# EAGLE design board (EAGLE 6.5.0)
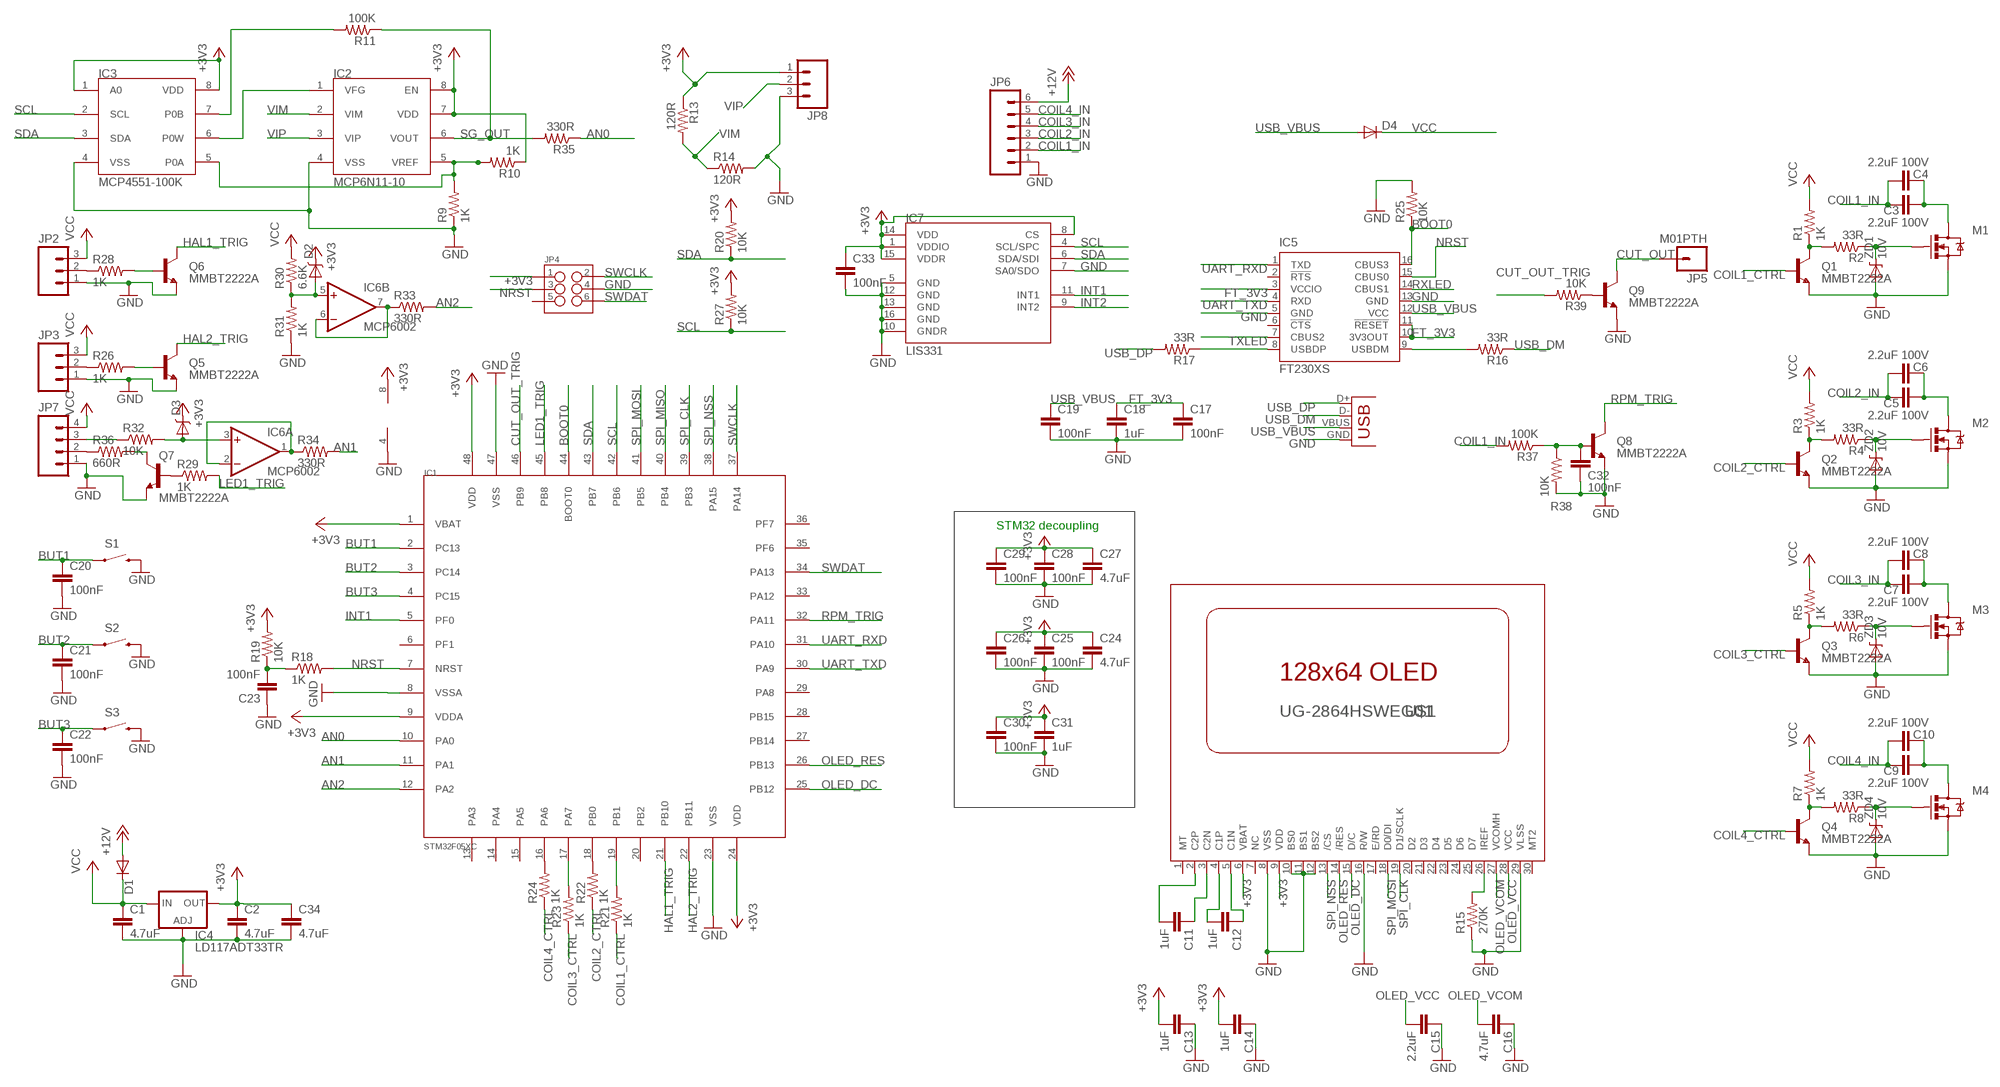
[diagram p0: schematic, sheet 1]

## Parts
C1  4.7uF  CAP0603-CAP  [0603-CAP]
C2  4.7uF  CAP0603-CAP  [0603-CAP]
C3  2.2uF 100V  2.2UF-CERCAP-10009  [1206]
C4  2.2uF 100V  2.2UF-CERCAP-10009  [1206]
C5  2.2uF 100V  2.2UF-CERCAP-10009  [1206]
C6  2.2uF 100V  2.2UF-CERCAP-10009  [1206]
C7  2.2uF 100V  2.2UF-CERCAP-10009  [1206]
C8  2.2uF 100V  2.2UF-CERCAP-10009  [1206]
C9  2.2uF 100V  2.2UF-CERCAP-10009  [1206]
C10  2.2uF 100V  2.2UF-CERCAP-10009  [1206]
C11  1uF  CAP0603-CAP  [0603-CAP]
C12  1uF  CAP0603-CAP  [0603-CAP]
C13  1uF  CAP0603-CAP  [0603-CAP]
C14  1uF  CAP0603-CAP  [0603-CAP]
C15  2.2uF  CAP0603-CAP  [0603-CAP]
C16  4.7uF  CAP0603-CAP  [0603-CAP]
C17  100nF  CAP0603-CAP  [0603-CAP]
C18  1uF  CAP0603-CAP  [0603-CAP]
C19  100nF  CAP0603-CAP  [0603-CAP]
C20  100nF  CAP0603-CAP  [0603-CAP]
C21  100nF  CAP0603-CAP  [0603-CAP]
C22  100nF  CAP0603-CAP  [0603-CAP]
C23  100nF  CAP0603-CAP  [0603-CAP]
C24  4.7uF  CAP0603-CAP  [0603-CAP]
C25  100nF  CAP0603-CAP  [0603-CAP]
C26  100nF  CAP0603-CAP  [0603-CAP]
C27  4.7uF  CAP0603-CAP  [0603-CAP]
C28  100nF  CAP0603-CAP  [0603-CAP]
C29  100nF  CAP0603-CAP  [0603-CAP]
C30  100nF  CAP0603-CAP  [0603-CAP]
C31  1uF  CAP0603-CAP  [0603-CAP]
C32  100nF  CAP0603-CAP  [0603-CAP]
C33  100nF  CAP0603-CAP  [0603-CAP]
C34  4.7uF  CAP0603-CAP  [0603-CAP]
D1  DIODESMA  [SMA-DIODE]
D2  BAT20JFILM  [SOD-323]
D3  BAT20JFILM  [SOD-323]
D4  DIODESMA  [SMA-DIODE]
IC1  STM32F05XC  [LQFP-48]
IC2  MCP6N11-10  MCP6N11  [SO08]
IC3  MCP4551-100K  MCP45X1  [MSOP-8]
IC4  LD117ADT33TR  [DPACK]
IC5  FT230XS  [SSOP16]
IC6  MCP6002  TL072D  [SO08]
IC7  LIS331  [LGA16-3MM]
JP1  USBSMD  [USB-MINIB]
JP2  M03PTH  [1X03]
JP3  M03PTH  [1X03]
JP4  M03X22X3_SILK_SM  [2X3]
JP5  M01PTH  [1X01]
JP6  M063.5MM-6  [SCREWTERMINAL-3.5MM-6]
JP7  M04PTH  [1X04]
JP8  M03PTH  [1X03]
M1  MOSFET-NCHANNELFDD8580  [DPAK]
M2  MOSFET-NCHANNELFDD8580  [DPAK]
M3  MOSFET-NCHANNELFDD8580  [DPAK]
M4  MOSFET-NCHANNELFDD8580  [DPAK]
Q1  MMBT2222A  TRANSISTOR_NPNMMBT2222A  [SOT23]
Q2  MMBT2222A  TRANSISTOR_NPNMMBT2222A  [SOT23]
Q3  MMBT2222A  TRANSISTOR_NPNMMBT2222A  [SOT23]
Q4  MMBT2222A  TRANSISTOR_NPNMMBT2222A  [SOT23]
Q5  MMBT2222A  TRANSISTOR_NPNMMBT2222A  [SOT23]
Q6  MMBT2222A  TRANSISTOR_NPNMMBT2222A  [SOT23]
Q7  MMBT2222A  TRANSISTOR_NPNMMBT2222A  [SOT23]
Q8  MMBT2222A  TRANSISTOR_NPNMMBT2222A  [SOT23]
Q9  MMBT2222A  TRANSISTOR_NPNMMBT2222A  [SOT23]
R1  1K  RESISTOR0603-RES  [0603-RES]
R2  33R  RESISTOR0603-RES  [0603-RES]
R3  1K  RESISTOR0603-RES  [0603-RES]
R4  33R  RESISTOR0603-RES  [0603-RES]
R5  1K  RESISTOR0603-RES  [0603-RES]
R6  33R  RESISTOR0603-RES  [0603-RES]
R7  1K  RESISTOR0603-RES  [0603-RES]
R8  33R  RESISTOR0603-RES  [0603-RES]
R9  1K  RESISTOR0603-RES  [0603-RES]
R10  1K  RESISTOR0603-RES  [0603-RES]
R11  100K  RESISTOR0603-RES  [0603-RES]
R13  120R  RESISTOR0603-RES  [0603-RES]
R14  120R  RESISTOR0603-RES  [0603-RES]
R15  270K  RESISTOR0603  [0603-RES]
R16  33R  RESISTOR0603-RES  [0603-RES]
R17  33R  RESISTOR0603-RES  [0603-RES]
R18  1K  RESISTOR0603-RES  [0603-RES]
R19  10K  RESISTOR0603-RES  [0603-RES]
R20  10K  RESISTOR0603-RES  [0603-RES]
R21  1K  RESISTOR0603-RES  [0603-RES]
R22  1K  RESISTOR0603-RES  [0603-RES]
R23  1K  RESISTOR0603-RES  [0603-RES]
R24  1K  RESISTOR0603-RES  [0603-RES]
R25  10K  RESISTOR0603-RES  [0603-RES]
R26  1K  RESISTOR0603-RES  [0603-RES]
R27  10K  RESISTOR0603-RES  [0603-RES]
R28  1K  RESISTOR0603-RES  [0603-RES]
R29  1K  RESISTOR0603-RES  [0603-RES]
R30  6.6K  RESISTOR0603-RES  [0603-RES]
R31  1K  RESISTOR0603-RES  [0603-RES]
R32  10K  RESISTOR0603-RES  [0603-RES]
R33  330R  RESISTOR0603-RES  [0603-RES]
R34  330R  RESISTOR0603-RES  [0603-RES]
R35  330R  RESISTOR0603-RES  [0603-RES]
R36  660R  RESISTOR1206  [1206]
R37  100K  RESISTOR1206  [1206]
R38  10K  RESISTOR0603-RES  [0603-RES]
R39  10K  RESISTOR0603-RES  [0603-RES]
S1  SWITCH-MOMENTARY-2  [TACTILE_SWITCH_TALL]
S2  SWITCH-MOMENTARY-2  [TACTILE_SWITCH_TALL]
S3  SWITCH-MOMENTARY-2  [TACTILE_SWITCH_TALL]
U$1  UG-2864HSWEG01  [1X30-0.7MM]
ZD1  10V  DIODE-ZENER-BZT52  [SOD-323]
ZD2  10V  DIODE-ZENER-BZT52  [SOD-323]
ZD3  10V  DIODE-ZENER-BZT52  [SOD-323]
ZD4  10V  DIODE-ZENER-BZT52  [SOD-323]

## Nets
+3V3: C2.1 C13.2 C14.2 C24.1 C25.1 C26.1 C27.1 C28.1 C29.1 C30.1 C31.1 C33.1 C34.1 D2.1(C) D3.1(C) IC1.1(VBAT) IC1.9(VDDA) IC1.24(VDD) IC1.48(VDD) IC2.7(VDD) IC2.8(EN) IC3.1(A0) IC3.8(VDD) IC4.4(OUT) IC6.8(P:V+) IC7.1(VDDIO) IC7.8(CS) IC7.14(VDD) IC7.15(VDDR) JP4.1 JP8.1 R10.1 R13.1 R19.2 R20.2 R27.2 U$1.6(VBAT) U$1.9(VDD)
+12V: D1.A JP6.6
AN0: IC1.10(PA0) R35.1
AN1: IC1.11(PA1) R34.2
AN2: IC1.12(PA2) R33.2
BOOT0: IC1.44(BOOT0) IC5.16(CBUS3) R25.1
BUT1: C20.1 IC1.2(PC13) S1.A2
BUT2: C21.1 IC1.3(PC14) S2.A2
BUT3: C22.1 IC1.4(PC15) S3.A2
COIL1_CTRL: Q1.1(B) R21.1
COIL1_IN [HV]: C3.1 C4.1 JP6.2 R37.2
COIL2_CTRL: Q2.1(B) R22.1
COIL2_IN [HV]: C5.1 C6.1 JP6.3
COIL3_CTRL: Q3.1(B) R23.1
COIL3_IN [HV]: C7.1 C8.1 JP6.4
COIL4_CTRL: Q4.1(B) R24.1
COIL4_IN [HV]: C9.1 C10.1 JP6.5
CUT_OUT: JP5.1 Q9.3(C)
CUT_OUT_TRIG: IC1.46(PB9) R39.2
FT_3V3: C17.1 C18.1 IC5.3(VCCIO) IC5.10(3V3OUT) IC5.11(!RESET)
GND: C1.2 C2.2 C13.1 C14.1 C15.1 C16.1 C17.2 C18.2 C19.2 C20.2 C21.2 C22.2 C23.1 C24.2 C25.2 C26.2 C27.2 C28.2 C29.2 C30.2 C31.2 C32.2 C33.2 C34.2 IC1.8(VSSA) IC1.23(VSS) IC1.47(VSS) IC2.4(VSS) IC3.4(VSS) IC4.1(ADJ) IC5.5(GND) IC5.13(GND) IC6.4(P:V-) IC7.5(GND) IC7.7(SA0/SDO) IC7.10(GNDR) IC7.12(GND) IC7.13(GND) IC7.16(GND) JP1.GND JP2.1 JP3.1 JP4.4 JP6.1 JP7.1 JP8.3 M1.3(S) M2.3(S) M3.3(S) M4.3(S) Q1.2(E) Q2.2(E) Q3.2(E) Q4.2(E) Q5.2(E) Q6.2(E) Q7.2(E) Q8.2(E) Q9.2(E) R9.1 R14.2 R15.1 R25.2 R31.1 R38.2 S1.B2 S2.B2 S3.B2 U$1.8(VSS) U$1.10(BS0) U$1.11(BS1) U$1.12(BS2) U$1.16(R/W) U$1.29(VLSS) ZD1.2(A) ZD2.2(A) ZD3.2(A) ZD4.2(A)
HAL1_TRIG: IC1.21(PB10) Q6.3(C)
HAL2_TRIG: IC1.22(PB11) Q5.3(C)
INT1: IC1.5(PF0) IC7.11(INT1)
INT2: IC7.9(INT2)
LED1_TRIG: IC1.45(PB8) R29.2
N$1 [HV]: C3.2 C4.2 M1.4(D)
N$2: M1.1(G) R2.1 ZD1.1(C)
N$3 [HV]: C5.2 C6.2 M2.4(D)
N$4: M2.1(G) R4.1 ZD2.1(C)
N$5 [HV]: C7.2 C8.2 M3.4(D)
N$6: M3.1(G) R6.1 ZD3.1(C)
N$7 [HV]: C9.2 C10.2 M4.4(D)
N$8: M4.1(G) R8.1 ZD4.1(C)
N$9: IC2.1(VFG) IC3.6(P0W)
N$10: C12.2 U$1.4(C1P)
N$11: IC1.16(PA6) R24.2
N$12: IC2.5(VREF) IC3.5(P0A) R9.2 R10.2
N$13: C12.1 U$1.5(C1N)
N$14: IC3.7(P0B) R11.2
N$15: C11.1 U$1.3(C2N)
N$16: C11.2 U$1.2(C2P)
N$17: C23.2 R18.1 R19.1
N$18: R15.2 U$1.26(IREF)
N$19: IC1.17(PA7) R23.2
N$20: IC1.18(PB0) R22.2
N$21: IC5.8(USBDP) R17.1
N$22: IC5.9(USBDM) R16.2
N$23: IC1.19(PB1) R21.2
N$24: D2.2(A) IC6.5(B:+IN) R30.1 R31.2
N$25: D3.2(A) IC6.3(A:+IN) R32.2
N$26: JP7.3 R32.1
N$27: Q7.1(B) R29.1
N$28: JP7.2 R36.1
N$29: IC6.6(B:-IN) IC6.7(B:OUT) R33.1
N$30: Q5.1(B) R26.2
N$31: JP3.2 R26.1
N$32: Q6.1(B) R28.2
N$33: JP2.2 R28.1
N$34: Q7.3(C) R36.2
N$35: IC6.1(A:OUT) IC6.2(A:-IN) R34.1
N$36: C32.1 Q8.1(B) R37.1 R38.1
N$37: Q9.1(B) R39.1
NMOS1_GATE: Q1.3(C) R1.1 R2.2
NMOS2_GATE: Q2.3(C) R3.1 R4.2
NMOS3_GATE: Q3.3(C) R5.1 R6.2
NMOS4_GATE: Q4.3(C) R7.1 R8.2
NRST: IC1.7(NRST) IC5.15(CBUS0) JP4.3 R18.2
OLED_DC: IC1.25(PB12) U$1.15(D/C)
OLED_RES: IC1.26(PB13) U$1.14(/RES)
OLED_VCC: C15.2 U$1.28(VCC)
OLED_VCOM: C16.2 U$1.27(VCOMH)
RPM_TRIG: IC1.32(PA11) Q8.3(C)
RXLED: IC5.14(CBUS1)
SCL: IC1.42(PB6) IC3.2(SCL) IC7.4(SCL/SPC) R27.1
SDA: IC1.43(PB7) IC3.3(SDA) IC7.6(SDA/SDI) R20.1
SG_OUT: IC2.6(VOUT) R11.1 R35.2
SPI_CLK: IC1.39(PB3) U$1.19(D1/SCLK)
SPI_MISO: IC1.40(PB4)
SPI_MOSI: IC1.41(PB5) U$1.18(D0/DI)
SPI_NSS: IC1.38(PA15) U$1.13(/CS)
SWCLK: IC1.37(PA14) JP4.2
SWDAT: IC1.34(PA13) JP4.6
TXLED: IC5.7(CBUS2)
UART_RXD: IC1.31(PA10) IC5.1(TXD)
UART_TXD: IC1.30(PA9) IC5.4(RXD)
USB_DM: JP1.D- R16.1
USB_DP: JP1.D+ R17.2
USB_VBUS: C19.1 D4.A IC5.12(VCC) JP1.VBUS
VCC: C1.1 D1.C D4.C IC4.3(IN) JP2.3 JP3.3 JP7.4 R1.2 R3.2 R5.2 R7.2 R30.2
VIM: IC2.2(VIM) R13.2 R14.1
VIP: IC2.3(VIP) JP8.2
Unconnected: IC1.6(PF1) IC1.13(PA3) IC1.14(PA4) IC1.15(PA5) IC1.20(PB2) IC1.27(PB14) IC1.28(PB15) IC1.29(PA8) IC1.33(PA12) IC1.35(PF6) IC1.36(PF7) IC5.2(!RTS) IC5.6(!CTS) JP4.5 U$1.1(MT) U$1.7(NC) U$1.17(E/RD) U$1.20(D2) U$1.21(D3) U$1.22(D4) U$1.23(D5) U$1.24(D6) U$1.25(D7) U$1.30(MT2)

## Notes on the sheet
- STM32 decoupling

## Library data of the parts
C1 C2 C24 C27 C34 = SparkFun-Passives:CAP: Capacitor Standard 0603 ceramic capacitor, and 0.1" leaded capacitor.
C3-C10 = SparkFun-Capacitors:2.2UF-CER: 2.2uF Ceramic SMT CAP-07888- 10V, 20% (0603) CAP-10009- 50V, 10% (1206); PROD_ID: CAP-10009; VALUE: 2.2uF
C11-C23 C25 C26 C28-C33 = SparkFun-Capacitors:CAP: Capacitor Standard 0603 ceramic capacitor, and 0.1" leaded capacitor.
D1 D4 = SparkFun-DiscreteSemi:DIODE: Diode These are standard reverse protection diodes and small signal diodes. SMA package can handle up to about 1A. SOD-323 can handle about 200mA. What the SOD-323 package when ordering, there are some mfgs out there that are 5-pin packages.
D2 D3 = SparkFun-DiscreteSemi:BAT20JFILM: 23V, 1A Schottky diode, SOD-323 package; PROD_ID: DIO-11623; VALUE: BAT20JFILM
IC1 = misc:STM32F05XC
IC2 = misc:MCP6N11
IC3 = misc:MCP45X1
IC4 = v-reg:LD117A?*: Low drop fixed and adjustable positive voltage regulators 1 A Source: http://www.st.com/stonline/products/literature/ds/7194/ld1117axx.pdf
IC5 = ftdichip:FT230X: USB to BASIC UART IC Auto generated by make-symbol-device-package-bsdl.ulp Rev. 43 Source: Data sheet <http://www.ftdichip.com/Support/Documents/DataSheets/ICs/DS_FT230X.pdf>
IC6 = linear:TL072: OP AMP
IC7 = SparkFun-Sensors:LIS331: 3-axis 6/12/24g SPI/I2C accelerometer
JP1 = SparkFun-Connectors:USB: USB Connectors USB-B-PTH is fully proven SKU : PRT-00139/CONN-08278 USB-miniB is fully proven SKU : PRT-00587 USB-A-PCB is untested. USB-A-H is throughly reviewed, but untested. Spark Fun Electronics SKU : PRT-00437 USB-B-SMT is throughly reviewed, but untested. Needs silkscreen touching up. USB-A-S has not been used/tested USB-MB-H has not been used/tested USB-MICROB has been used. CONN-09505
JP2 JP3 JP8 = SparkFun-Connectors:M03: Header 3 Standard 3-pin 0.1" header. Use with straight break away headers (SKU : PRT-00116), right angle break away headers (PRT-00553), swiss pins (PRT-00743), machine pins (PRT-00117), and female headers (PRT-00115). Molex polarized connector foot print use with SKU : PRT-08232 with associated crimp pins and housings.
JP4 = SparkFun-Connectors:M03X2: 2x3 .1" header. Shrouded, with keying- CONN-10681 SMT- CONN-11415 Pogo pins- HW-11044
JP5 = SparkFun-Connectors:M01: Header 1 Standard 1-pin 0.1" header. Use with straight break away headers (SKU : PRT-00116), right angle break away headers (PRT-00553), swiss pins (PRT-00743), machine pins (PRT-00117), and female headers (PRT-00115).
JP6 = SparkFun-Connectors:M06: Header 6 Standard 6-pin 0.1" header. Use with straight break away headers (SKU : PRT-00116), right angle break away headers (PRT-00553), swiss pins (PRT-00743), machine pins (PRT-00117), and female headers (PRT-00115). Molex polarized connector foot print use with SKU : PRT-08094 with associated crimp pins and housings. NOTES ON THE VARIANTS LOCK and LOCK_LONGPADS... This footprint was designed to help hold the alignment of a through-hole component (i.e. 6-pin header) while soldering it into place. You may notice that each hole has been shifted either up or down by 0.005 of an inch from it's more standard position (which is a perfectly straight line). This slight alteration caused the pins (the squares in the middle) to touch the edges of the holes. Because they are alternating, it causes a "brace" to hold the component in place. 0.005 has proven to be the perfect amount of "off-center" position when using our standard breakaway headers. Although looks a little odd when you look at the bare footprint, once you have a header in there, the alteration is very hard to notice. Also, if you push a header all the way into place, it is covered up entirely on the bottom side. This idea of altering the position of holes to aid alignment will be further integrated into the Sparkfun Library for other footprints. It can help hold any component with 3 or more connection pins.
JP7 = SparkFun-Connectors:M04: Header 4 Standard 4-pin 0.1" header. Use with straight break away headers (SKU : PRT-00116), right angle break away headers (PRT-00553), swiss pins (PRT-00743), machine pins (PRT-00117), and female headers (PRT-00115). Molex polarized connector foot print use with SKU : PRT-08231 with associated crimp pins and housings. 1MM SMD Version SKU: PRT-10208
M1-M4 = SparkFun-DiscreteSemi:MOSFET-NCHANNEL: Generic NMOS footprint
Q1-Q9 = SparkFun-DiscreteSemi:TRANSISTOR_NPN: Generic NPN BJT MMBT2222A - TRANS-08049 (SOT-23, 1A 40V) MPSA42 - TRANS-09116 (SOT-23, 500mA 300V) MMBT5088LT1G - TRANS-11160 (SOT-23, 50 mA 30V); PROD_ID: TRANS-08049
R1-R11 R13-R39 = SparkFun-Resistors:RESISTOR: Resistor Basic schematic elements and footprints for 0603, 1206, and PTH resistors.
S1-S3 = SparkFun-Electromechanical:SWITCH-MOMENTARY-2: Various NO switches- pushbuttons, reed, etc
U$1 = SparkFun:UG-2864HSWEG01: UG-2864HSWEG01 OLED display
ZD1-ZD4 = SparkFun-DiscreteSemi:DIODE-ZENER: Zener Diode Production Part - 8199 3.4V Zener Voltage

## Net classes
1 HV: width 0.813 mm, clearance 0.61 mm

## Board
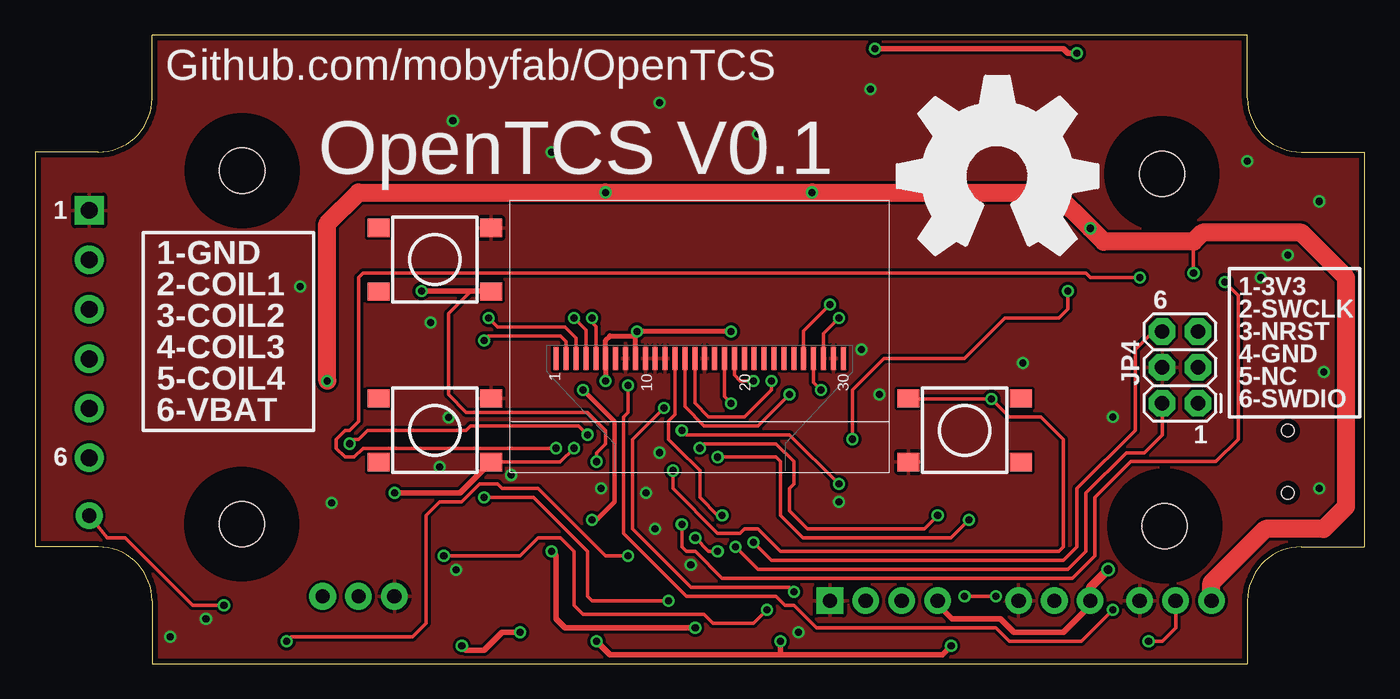
[diagram p1: board, top side]
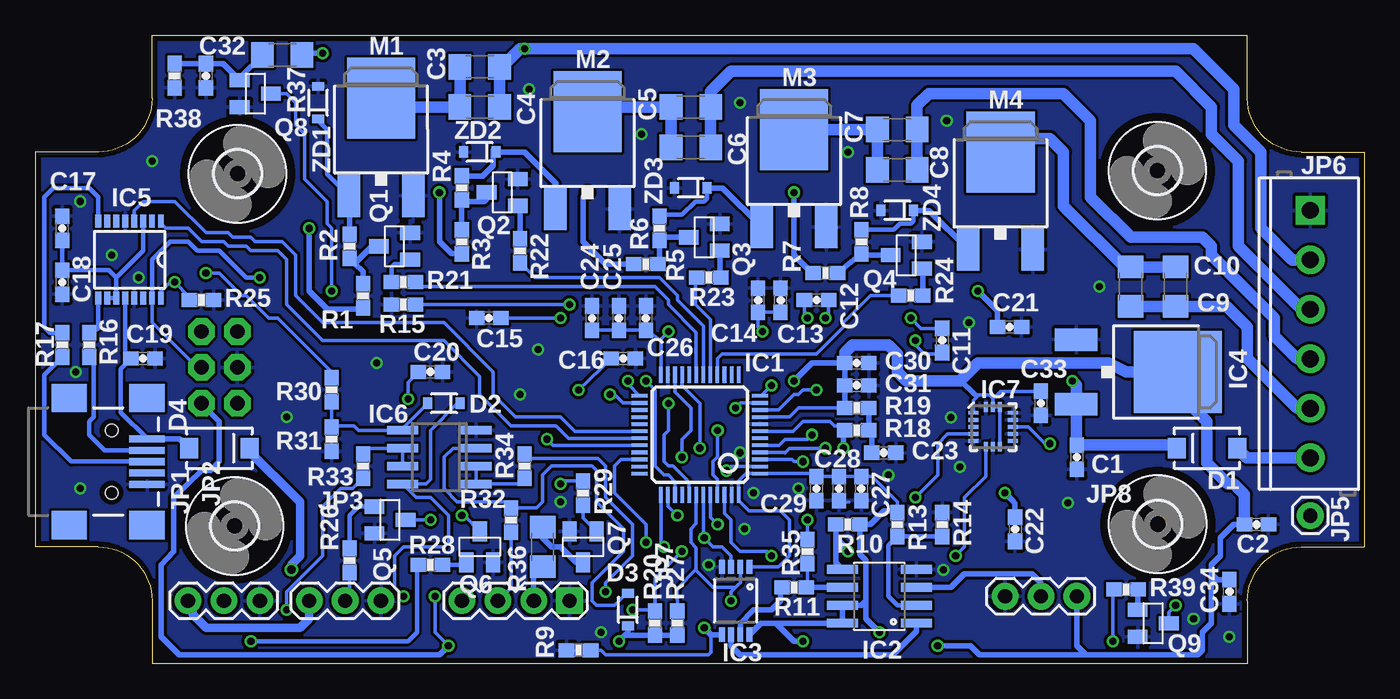
[diagram p2: board, bottom side, seen from below]

Size 93.98 x 44.45 mm. Coordinates in mm from the lower left corner, seen from the top.
Outline: 8.26,0 85.72,0 85.72,4.45 arc-90 89.53,8.26 93.98,8.26 93.98,36.2 89.53,36.2 arc-90 85.72,40.01 85.72,44.45 8.26,44.45 8.26,40.01 arc-90 4.45,36.2 0,36.2 0,8.26 4.45,8.26 arc-90 8.26,4.45 8.26,0
Copper layers (1*16): Top 0.0356mm / dielectric 1.5011mm / Bottom 0.0356mm
Design rules "LaenPCBOrder *": minimum track width 6mil, minimum drill 0.5mm, track to track 8mil, track to pad 8mil, pad to pad 8mil, via to via 8mil, smd to smd 8mil, copper to edge 15mil, drill to drill 6mil, minimum pad ring 7mil, minimum via ring 7mil, stop-mask expansion 4mil, vias tented up to drill 100mil, thermal gap 10mil

### Footprints (pad centres in the part's own frame; a part is rotated, then mirrored left to right if it is on the bottom)
0603-CAP = smd 1.1 x 1: 1 -0.85,0; 2 0.85,0
1206 = smd 1.6 x 1.8: 1 -1.4,0; 2 1.4,0
SMA-DIODE = smd 1.27 x 1.47: A -2.15,0; C 2.15,0
SOD-323 = smd 0.63 x 0.83: 1 -1.15,0; 2 1.15,0
LQFP-48 = smd 0.254 x 1.143: 1 -2.75,-4.25; 2 -2.25,-4.25; 3 -1.75,-4.25; 4 -1.25,-4.25; 5 -0.75,-4.25; 6 -0.25,-4.25; 7 0.25,-4.25; 8 0.75,-4.25; 9 1.25,-4.25; 10 1.75,-4.25; 11 2.25,-4.25; 12 2.75,-4.25; 25 2.75,4.25; 26 2.25,4.25; 27 1.75,4.25; 28 1.25,4.25; 29 0.75,4.25; 30 0.25,4.25; 31 -0.25,4.25; 32 -0.75,4.25; 33 -1.25,4.25; 34 -1.75,4.25; 35 -2.25,4.25; 36 -2.75,4.25 | smd 1.143 x 0.254: 13 4.25,-2.75; 14 4.25,-2.25; 15 4.25,-1.75; 16 4.25,-1.25; 17 4.25,-0.75; 18 4.25,-0.25; 19 4.25,0.25; 20 4.25,0.75; 21 4.25,1.25; 22 4.25,1.75; 23 4.25,2.25; 24 4.25,2.75; 37 -4.25,2.75; 38 -4.25,2.25; 39 -4.25,1.75; 40 -4.25,1.25; 41 -4.25,0.75; 42 -4.25,0.25; 43 -4.25,-0.25; 44 -4.25,-0.75; 45 -4.25,-1.25; 46 -4.25,-1.75; 47 -4.25,-2.25; 48 -4.25,-2.75
SO08 = smd 0.61 x 2.21: 1 -1.905,-2.616; 2 -0.635,-2.616; 3 0.635,-2.616; 4 1.905,-2.616; 5 1.905,2.616; 6 0.635,2.616; 7 -0.635,2.616; 8 -1.905,2.616
MSOP-8 = smd 0.41 x 1.02: 1 -0.975,-2.4; 2 -0.325,-2.4; 3 0.325,-2.4; 4 0.975,-2.4; 5 0.975,2.4; 6 0.325,2.4; 7 -0.325,2.4; 8 -0.975,2.4
DPACK = smd 1.6 x 3: 1 -2.28,-4.8; 3 2.28,-4.8 | smd 5.8 x 6.2: 4 0,2.38
SSOP16 = smd 0.914 x 0.406: 1 -2.718,2.223; 2 -2.718,1.587; 3 -2.718,0.953; 4 -2.718,0.318; 5 -2.718,-0.318; 6 -2.718,-0.953; 7 -2.718,-1.587; 8 -2.718,-2.223; 9 2.718,-2.223; 10 2.718,-1.587; 11 2.718,-0.953; 12 2.718,-0.318; 13 2.718,0.318; 14 2.718,0.953; 15 2.718,1.587; 16 2.718,2.223
SO08' = smd 0.6 x 2.2: 1 -1.905,-2.6; 2 -0.635,-2.6; 3 0.635,-2.6; 4 1.905,-2.6; 5 1.905,2.6; 6 0.635,2.6; 7 -0.635,2.6; 8 -1.905,2.6
LGA16-3MM = smd 0.7 x 0.28: 1 -1.4,1; 2 -1.4,0.5; 3 -1.4,0; 4 -1.4,-0.5; 5 -1.4,-1; 9 1.4,-1; 10 1.4,-0.5; 11 1.4,0; 12 1.4,0.5; 13 1.4,1 | smd 0.28 x 0.7: 6 -0.5,-1.4; 7 0,-1.4; 8 0.5,-1.4; 14 0.5,1.4; 15 0,1.4; 16 -0.5,1.4
USB-MINIB = smd 2.5 x 0.5: D+ 2.5,0; D- 2.5,0.8; GND 2.5,-1.6; ID 2.5,-0.8; VBUS 2.5,1.6 | smd 2.5 x 2: MTN1 -3,4.5; MTN2 2.5,4.5; MTN3 -3,-4.5; MTN4 2.5,-4.5 | hole 0.9: 0,2.2; 0,-2.2
1X03 = drill 1.016 pad 1.88: 1 0,0; 2 2.54,0; 3 5.08,0
2X3 = drill 1.016 pad 1.88 octagon: 1 0,0; 2 0,2.54; 3 2.54,0; 4 2.54,2.54; 5 5.08,0; 6 5.08,2.54
1X01 = drill 1.016 pad 1.88: 1 0,0
SCREWTERMINAL-3.5MM-6 = drill 1.2 pad 2.032 square: 1 0,0 | drill 1.2 pad 2.032: 2 3.5,0; 3 7,0; 4 10.5,0; 5 14,0; 6 17.5,0
1X04 = drill 1.016 pad 1.88 square: 1 0,0 | drill 1.016 pad 1.88: 2 2.54,0; 3 5.08,0; 4 7.62,0
DPAK = smd 1.6 x 3: 1 -2.28,-5.31; 3 2.28,-5.31 | smd 4.826 x 5.715: 4 0,1.588
SOT23 = smd 1 x 1.4: 1 -0.95,-1.1; 2 0.95,-1.1; 3 0,1.1
0603-RES = smd 1.1 x 1: 1 -0.85,0; 2 0.85,0
TACTILE_SWITCH_TALL = smd 1.55 x 1.3: A1 -3.975,-2.25; A2 3.975,-2.25; B1 -3.975,2.25; B2 3.975,2.25
1X30-0.7MM = smd 0.35 x 1.6: 1 -10.15,-0.635; 2 -9.45,-0.635; 3 -8.75,-0.635; 4 -8.05,-0.635; 5 -7.35,-0.635; 6 -6.65,-0.635; 7 -5.95,-0.635; 8 -5.25,-0.635; 9 -4.55,-0.635; 10 -3.85,-0.635; 11 -3.15,-0.635; 12 -2.45,-0.635; 13 -1.75,-0.635; 14 -1.05,-0.635; 15 -0.35,-0.635; 16 0.35,-0.635; 17 1.05,-0.635; 18 1.75,-0.635; 19 2.45,-0.635; 20 3.15,-0.635; 21 3.85,-0.635; 22 4.55,-0.635; 23 5.25,-0.635; 24 5.95,-0.635; 25 6.65,-0.635; 26 7.35,-0.635; 27 8.05,-0.635; 28 8.75,-0.635; 29 9.45,-0.635; 30 10.15,-0.635
3,2 = hole 3.2: 0,0

### Placement (x,y rotation side)
C1  20.32,14.61 270 bottom
C2  7.62,9.84 0 bottom
C3  62.55,42.23 180 bottom
C4  62.55,39.37 180 bottom
C5  47.62,39.37 180 bottom
C6  47.62,36.51 180 bottom
C7  33.02,37.78 180 bottom
C8  33.02,34.92 180 bottom
C9  16.51,26.67 90 bottom
C10  13.34,26.67 90 bottom
C11  29.84,22.86 270 bottom
C12  38.73,25.72 0 bottom
C13  41.27,25.72 270 bottom
C14  42.86,25.72 270 bottom
C15  61.91,24.45 0 bottom
C16  52.39,21.59 180 bottom
C17  92.08,30.8 90 bottom
C18  92.08,26.99 270 bottom
C19  86.36,21.59 0 bottom
C20  66.04,20.64 0 bottom
C21  25.08,23.81 0 bottom
C22  24.68,9.5 270 bottom
C23  33.97,14.92 180 bottom
C24  54.61,24.45 90 bottom
C25  52.7,24.45 90 bottom
C26  50.8,24.45 90 bottom
C27  35.56,12.38 270 bottom
C28  37.15,12.38 270 bottom
C29  38.73,12.38 270 bottom
C30  35.88,21.27 0 bottom
C31  35.88,19.68 0 bottom
C32  81.92,41.59 270 bottom
C33  22.86,18.41 270 bottom
C34  9.53,5.08 270 bottom
D1  11.11,15.24 180 bottom
D2  65.09,18.41 180 bottom
D3  52.07,3.81 90 bottom
D4  80.96,15.24 0 bottom
IC1  46.99,16.19 90 bottom
IC2  34.29,4.76 90 bottom
IC3  44.45,4.45 180 bottom
IC4  15.56,20.64 270 bottom
IC5  87.31,28.57 270 bottom
IC6  MCP6002  [SO08']  65.41,14.61 90 bottom
IC7  26.25,16.75 0 bottom
JP1  88.58,14.29 0 bottom
JP2  78.11,4.45 180 bottom
JP3  69.53,4.45 180 bottom
JP4  82.23,18.41 90 top
JP5  3.81,10.48 0 bottom
JP6  3.81,32.07 270 bottom
JP7  56.2,4.45 180 bottom
JP8  20.32,4.76 180 bottom
M1  69.53,38.42 0 bottom
M2  54.93,37.47 0 bottom
M3  40.32,36.2 0 bottom
M4  25.72,34.61 0 bottom
Q1  68.58,29.53 90 bottom
Q2  60.96,33.34 90 bottom
Q3  46.67,30.16 90 bottom
Q4  32.38,28.89 90 bottom
Q5  68.9,10.16 270 bottom
Q6  62.55,8.26 0 bottom
Q7  55.24,8.26 180 bottom
Q8  78.42,40.32 270 bottom
Q9  14.92,2.86 270 bottom
R1  70.8,26.04 270 bottom
R2  71.75,29.53 270 bottom
R3  63.82,29.84 270 bottom
R4  63.82,33.66 270 bottom
R5  50.8,28.26 180 bottom
R6  49.85,30.8 270 bottom
R7  38.1,27.62 180 bottom
R8  35.56,29.84 270 bottom
R9  55.56,0.95 0 bottom
R10  36.51,9.84 180 bottom
R11  40.32,5.4 180 bottom
R13  33.02,9.84 270 bottom
R14  29.84,9.84 90 bottom
R15  67.94,25.4 0 bottom
R16  90.17,22.54 90 bottom
R17  92.08,22.54 270 bottom
R18  35.88,16.51 180 bottom
R19  35.88,18.1 180 bottom
R20  50.16,2.86 270 bottom
R21  67.94,26.99 0 bottom
R22  59.69,29.21 270 bottom
R23  46.35,27.3 180 bottom
R24  32.07,26.04 180 bottom
R25  82.23,25.72 0 bottom
R26  71.75,7.3 90 bottom
R27  48.58,2.86 270 bottom
R28  66.04,6.99 0 bottom
R29  55.24,12.06 90 bottom
R30  73.03,19.37 90 bottom
R31  73.03,15.88 90 bottom
R32  60.33,10.16 90 bottom
R33  70.8,13.97 270 bottom
R34  59.37,13.97 90 bottom
R35  39.37,7.94 270 bottom
R36  58.1,8.26 90 bottom
R37  76.52,43.05 0 bottom
R38  84.14,41.59 270 bottom
R39  16.83,5.25 180 bottom
S1  65.72,16.51 180 top
S2  28.26,28.57 0 top
S3  28.26,16.51 0 top
U$1  46.99,22.23 0 top
U$2  [3,2]  14.62,34.88 0 bottom
U$3  [3,2]  14.61,9.87 0 bottom
U$4  [3,2]  79.69,34.65 0 bottom
U$5  [3,2]  79.88,9.73 0 bottom
U$6  [OSHW_FILLX500_NOTEXT]  60.96,28.89 0 top
ZD1  73.98,39.69 90 bottom
ZD2  62.55,36.2 180 bottom
ZD3  47.62,33.66 180 bottom
ZD4  33.02,32.07 180 bottom

### Tracks (layer width: path | path; a pad name or v marks a point on that pad's centre or on a via)
+3V3  (via drill 0.5, 0.5 pad 0.69)
  Top 0.254: 42.44,23.39 v42.55,23.5 | 40.32,21.57 U$1.6 | v67.94,4.76 v65.72,4.76
  Top 0.356: U$1.9 42.44,23.39 | U$1.6 40.34,22.88 40.64,23.18 42.23,23.18 v42.55,23.5 v49.21,23.5 | 40.32,21.57 v40.32,20
  Top 0.406: v34.29,2.22 33.02,2.22 31.75,0.95 30.48,0.95 v30.16,1.27 | 52.7,0.64 64.14,0.64 v64.77,1.27 | 52.7,0.64 40.64,0.64 v39.69,1.59 | v52.7,1.59 52.7,0.64
  Bottom 0.254: IC1.24 49.74,22.86 | C24.1 C25.1 C26.1 49.74,22.86 | C13.2 C14.2 42.86,23.81 v42.55,23.5 | IC1.9 40.66,17.44 40.01,18.1 R19.2 | R13.1 33.02,11.43 34.82,13.23 C27.1 C28.1 C29.1 38.95,13.44 IC1.1 43.71,13.44 44.24,12.91 IC1.48 44.24,11.54 43.5,10.79 41.27,10.79 40.64,10.16 40.64,7.62 41.41,6.84 IC3.1 | 49.74,22.86 49.74,22.97 v49.21,23.5 | D2.1 64.14,18.41 66.04,16.51 66.04,13.02 66.36,12.7 IC6.8 67.05,11.75 66.04,11.75 64.77,10.48 64.77,8.57 65.09,8.26 67.94,8.26 68.58,7.62 68.58,5.4 v67.94,4.76 | v65.72,4.76 65.72,2.22 v64.77,1.27 | IC7.1 27.65,18.6 27.25,19 | 27.25,19 26.5,19 26.25,18.75 | 26.25,18.75 IC7.15 IC7.14 IC7.8 | 27.25,19 27.5,19 | C33.1 25.73,19.27 26.25,18.75
  Bottom 0.305: 8.79,9.84 C2.1
  Bottom 0.406: R19.2 C31.1 C30.1 39.05,21.27 v40.32,20 | 35.24,4.45 35.24,7.3 35.66,7.72 R10.1 34.92,9.84 33.97,10.79 33.12,10.79 R13.1 | 35.24,4.45 35.56,4.13 IC2.7 IC2.8 41.59,2.86 | 10.79,6.35 10.79,4.45 10.79,2.86 11.43,2.22 11.43,0.95 11.75,0.64 19.68,0.64 | 10.79,6.35 10.79,6.99 10.16,7.62 10.16,8.89 9.21,9.84 8.79,9.84 | IC3.8 42.66,2.86 41.59,2.86 | 35.24,4.45 35.24,3.17 v34.29,2.22 | v30.16,1.27 29.31,1.27 27.84,1.27 27.2,0.64 24.77,0.64 19.68,0.64 | v39.69,1.59 40.32,1.59 41.59,2.86 | v64.77,1.27 65.41,0.64 83.82,0.64 85.09,1.91 85.09,6.99 84.2,7.94 84.2,11.75 82.23,13.65 81.6,13.65 80.96,14.29 80.96,17.14 JP4.1 | 52.23,2.06 52.07,2.22 D3.1 | 52.23,2.06 v52.7,1.59 | R27.2 R20.2 52.17,2.01 52.23,2.06 | 27.5,19 28.54,20.04 | C34.1 10.38,5.93 10.79,6.35 | JP8.1 20.32,1.27 19.68,0.64
  Bottom 0.813: C30.1 36.73,22.01 36.2,22.54 33.66,22.54 33.02,21.91 33.02,20.64 32.38,20 28.57,20 28.54,20.04 27.3,21.27 18.1,21.27 16.83,20.64 IC4.4 13.18,19.21 11.11,17.14 11.11,14.19 9.63,12.7 9.21,12.7 8.47,11.96 C2.1
+12V
  Bottom 0.813: JP6.6 8.29,14.57 D1.A
AN0  (via drill 0.5 pad 0.69)
  Top 0.305: v39.37,10.16 39.69,10.16 40.96,11.43 40.96,17.14 v38.73,19.37
  Bottom 0.254: IC1.10 41.43,17.94 40.32,19.05 40.01,19.05 39.69,19.37 v38.73,19.37 | R35.1 v39.37,10.16
AN1  (via drill 0.5, 0.5 pad 0.69)
  Top 0.254: v53.66,5.08 53.34,5.4 46.35,5.4 42.23,9.53 42.23,15.88 v44.45,18.1
  Bottom 0.254: IC1.11 44.1,18.44 v44.45,18.1 | R34.2 59.05,14.5 54.19,14.5 53.66,13.97 53.66,11.75 51.75,9.84 51.75,7.62 53.66,5.71 v53.66,5.08
AN2  (via drill 0.5)
  Top 0.254: v41.91,19.68 41.91,17.78 41.59,17.46 41.59,9.21 46.04,4.76 52.39,4.76 53.02,4.13 53.66,4.13 55.24,2.54 67.94,2.54 68.9,1.59 73.98,1.59 v76.2,3.81
  Bottom 0.254: IC1.12 42.65,18.94 v41.91,19.68 | v76.2,3.81 76.2,5.08 73.66,7.62 73.66,11.11 72.39,12.38 71.54,12.38 R33.2
BOOT0  (via drill 0.5, 0.5 pad 0.69)
  Top 0.254: v84.14,26.99 85.09,26.04 85.09,15.88 83.5,14.29 77.47,14.29 74.93,11.75 74.93,7.62 73.34,6.03 48.58,6.03 46.67,7.94 46.04,7.94 45.72,8.26 v45.72,9.84
  Bottom 0.254: 85.09,26.35 84.45,26.99 v84.14,26.99 83.08,25.93 R25.1 | IC1.44 46.24,10.36 v45.72,9.84
  Bottom 0.305: IC5.16 85.09,26.35
BUT1  (via drill 0.5 pad 0.69)
  Top 0.254: S1.A2 61.77,18.73 v67.63,18.73 68.9,17.46 71.12,17.46 72.71,15.88 72.71,8.26 72.39,7.94 52.7,7.94 51.12,9.53 50.16,9.53 49.85,9.21 48.26,9.21 45.09,12.38 v45.09,13.65
  Bottom 0.254: IC1.2 44.8,13.94 v45.09,13.65 | v67.63,18.73 67.63,19.9 C20.1
BUT2  (via drill 0.5 pad 0.69)
  Top 0.254: S2.A2 30.77,26.32 29.21,24.77 29.21,19.05 30.48,17.78 39.05,17.78 40.32,16.51 40.32,15.56 39.69,14.92 v39.69,14.29
  Top 0.406: v27.3,26.35 32.2,26.35 S2.A2
  Bottom 0.254: v39.69,14.29 40.32,14.29 40.48,14.44 IC1.3
  Bottom 0.406: C21.1 25.93,24.98 v27.3,26.35
BUT3  (via drill 0.5, 0.5 pad 0.69)
  Top 0.254: S3.A2 37.12,14.26 v38.1,15.24
  Top 0.406: v25.4,12.06 30.04,12.06 S3.A2
  Bottom 0.254: v38.1,15.24 40.64,15.24 40.96,14.92 40.98,14.94 IC1.4
  Bottom 0.406: v25.4,12.06 24.84,11.51 24.68,11.35 C22.1
COIL1_CTRL
  Bottom 0.305: R21.1 68.8,28.04 68.58,28.26 67.8,28.26
  Bottom 0.406: 67.8,28.26 Q1.1
COIL1_IN  (via drill 0.5)
  Top 0.406: v73.66,43.18 73.03,43.18 72.71,43.5 v59.37,43.5
  Bottom 0.406: v73.66,43.18 74.99,43.18 R37.2
  Bottom 0.813: JP6.2 5.07,28.57 7.3,30.8 7.3,36.2 9.21,38.1 9.21,40.64 12.06,43.5 v59.37,43.5 59.69,43.5 60.96,42.23 C3.1 C4.1
COIL2_CTRL
  Bottom 0.406: R22.1 59.69,32.22 Q2.1
COIL2_IN
  Bottom 0.813: JP6.3 4.45,25.08 8.89,29.53 8.89,35.56 10.79,37.47 10.79,39.37 13.34,41.91 44.77,41.91 46.23,40.45 C5.1 C6.1
COIL3_CTRL
  Bottom 0.406: Q3.1 45.57,27.37 R23.1
COIL3_IN
  Bottom 0.813: JP6.4 4.76,21.59 6.35,23.18 6.35,24.45 10.79,28.89 10.79,29.53 11.43,30.16 13.34,30.16 16.51,30.16 19.37,33.02 19.37,38.42 21.27,40.32 30.8,40.32 31.62,39.5 C7.1 C8.1
COIL4_CTRL
  Bottom 0.406: R24.1 31.22,27.88 Q4.1
COIL4_IN
  Bottom 0.813: JP6.5 4.76,18.1 8.26,21.59 8.26,23.81 9.71,25.27 C10.1 C9.1
CUT_OUT  (via drill 0.5)
  Top 0.254: v13.34,4.13 11.11,4.13 6.35,8.89 5.4,8.89 5.08,8.89 JP5.1
  Bottom 0.254: Q9.3 13.82,3.64 v13.34,4.13
CUT_OUT_TRIG  (via drill 0.5)
  Top 0.254: v41.91,7.62 40.32,7.62 35.56,12.38 33.02,12.38 32.7,12.7 31.43,12.7 31.11,12.38 30.16,11.43 28.57,11.43 27.62,10.48 27.62,2.86 26.67,1.91 18.1,1.91 v17.78,1.59
  Bottom 0.254: IC1.46 45.24,10.63 44.77,10.16 44.77,8.57 44.13,7.94 42.23,7.94 v41.91,7.62 | v17.78,1.59 17.78,5.29 R39.2
FT_3V3
  Bottom 0.305: IC5.10 IC5.11 88.27,27.3 | 88.27,27.3 86.36,29.21 IC5.3 | C17.1 C18.1 88.8,27.84 88.27,27.3
GND  (via drill 0.5, 0.5 pad 0.69)
  Bottom 0.203: 36.42,11.43 36.83,11.43 C28.2
  other vias: 88.58,28.89 90.81,12.38 9.53,1.91 46.35,6.99 43.81,9.53 91.12,20.64 53.98,2.22 18.73,26.67 29.53,38.42 36.51,36.2 44.13,39.69 51.12,37.47 59.05,40.64 76.2,17.46 69.85,21.27 58.42,22.23 86.68,27.3 90.81,32.7 56.83,11.43 59.69,19.05 20.97,11.38 27.94,24.13 85.72,35.56 28.59,13.92 43.18,12.06 40.01,12.38 33.66,13.34 44.13,14.92 12.06,3.17 29.22,17.41 29.76,6.62
  pour Bottom: 0,44.45 93.98,44.45 93.98,0 0,0
  pour Top: 0,44.45 93.98,44.45 93.98,0 0,0
HAL1_TRIG  (via drill 0.5 pad 0.69)
  Top 0.254: v63.82,10.48 62.87,9.53 54.61,9.53 53.34,10.79 53.34,12.38 53.66,12.7 53.66,14.29 52.39,15.56 47.31,15.56 v46.99,15.24
  Bottom 0.254: 62.4,9.36 Q6.3 63.65,10.48 v63.82,10.48 | IC1.21 48.24,19.66 46.99,18.41 46.99,15.88 v46.99,15.24
HAL2_TRIG  (via drill 0.5 pad 0.69)
  Top 0.254: v48.26,14.61 52.39,14.61 52.7,14.29 52.7,10.48 54.29,8.89 64.77,8.89 v66.04,10.16
  Bottom 0.254: Q5.3 v66.04,10.16 | IC1.22 48.74,19.21 47.62,18.1 47.62,16.51 48.26,15.88 v48.26,14.61
INT1  (via drill 0.5)
  Top 0.254: v39.05,16.19 38.42,16.83 33.02,16.83 30.8,16.83 30.48,16.51 23.81,16.51 23.5,16.51 22.86,15.88 22.54,15.88 v22.23,15.56
  Bottom 0.254: IC1.5 41.39,15.44 40.96,15.88 39.37,15.88 v39.05,16.19 | IC7.11 23.73,16.75 22.54,15.56 v22.23,15.56
LED1_TRIG  (via drill 0.5)
  Top 0.254: v56.83,12.7 53.34,16.19 46.04,16.19 v45.72,16.51
  Bottom 0.254: R29.2 56.62,12.91 v56.83,12.7 | IC1.45 45.74,13.04 46.04,13.34 46.04,14.29 45.72,14.61 v45.72,16.51
N$1
  Bottom 0.813: C3.2 C4.2 68.58,39.37 M1.4
N$2
  Bottom 0.305: ZD1.1 73.98,38.42 73.34,37.78 73.34,34.64 M1.1
  Bottom 0.406: R2.1 71.75,33.37 M1.1
N$3
  Bottom 0.813: C6.2 C5.2 54.61,39.37 M2.4
N$4
  Bottom 0.406: M2.1 57.15,32.21 57.15,33.97 59.37,36.2 ZD2.1 61.59,36.31 61.59,35.24 62.33,34.51 R4.1
N$5
  Bottom 0.813: C8.2 C7.2 M3.4
N$6
  Bottom 0.305: 49.74,31.75 48.58,31.75 48.26,31.75 47.31,32.7 46.67,32.7 46.48,32.9 ZD3.1
  Bottom 0.406: ZD3.1 45.37,33.66 M3.1 | 49.74,31.75 R6.1
N$7
  Bottom 0.813: C10.2 C9.2 16.83,27.94 21.27,32.38 21.27,36.2 22.23,37.15 25.72,37.15 M4.4
N$8
  Bottom 0.305: R8.1 33.24,30.7 32.82,31.11 32.07,31.11 31.87,31.31 ZD4.1
  Bottom 0.406: ZD4.1 30.77,32.07 M4.1
N$9
  Bottom 0.305: 44.77,2.04 IC3.6
  Bottom 0.406: IC2.1 31.67,2.3 33.34,0.64 44.13,0.64 44.77,1.27 44.77,2.04
N$10  (via drill 0.5 pad 0.69)
  Top 0.254: v38.1,24.45 38.73,23.81 38.94,23.61 U$1.4
  Bottom 0.254: C12.2 37.88,24.66 v38.1,24.45
N$11
  Bottom 0.254: IC1.16 45.74,21.57 45.4,21.91 38.73,21.91 36.83,23.81 36.83,24.13 34.92,26.04 R24.2
N$12  (via drill 0.5 pad 0.69)
  Top 0.406: v46.67,2.54 37.47,2.54 36.83,3.17 36.83,7.62 v36.51,7.94
  Bottom 0.254: R9.2 53.98,0.95 53.66,0.64 46.35,0.64 46.18,0.81 46.18,2.04
  Bottom 0.305: v36.51,7.94 36.51,8.04
  Bottom 0.406: R10.2 37.36,8.89 | 37.36,8.89 37.36,7.12 IC2.5 | IC3.5 46.18,2.04 v46.67,2.54 | 36.51,8.04 37.36,8.89
N$13  (via drill 0.5 pad 0.69)
  Top 0.254: v39.37,24.45 39.37,24.13 39.64,23.86 39.64,23.45 U$1.5
  Bottom 0.254: C12.1 39.59,24.66 v39.37,24.45
N$14
  Bottom 0.305: 41.27,5.29 R11.2
  Bottom 0.406: IC3.7 44.12,2.87 43.18,3.81 41.91,3.81 41.27,4.45 41.27,5.29
N$15  (via drill 0.5 pad 0.69)
  Top 0.254: v32.07,24.45 32.7,23.81 37.47,23.81 38.1,23.18 38.24,23.04 U$1.3
  Bottom 0.254: C11.1 31.33,23.71 v32.07,24.45
N$16  (via drill 0.5 pad 0.69)
  Top 0.254: U$1.2 37.54,22.79 37.15,23.18 33.34,23.18 32.7,23.18 32.07,23.18 v31.75,22.86
  Bottom 0.254: v31.75,22.86 31.75,22.54 31.11,21.91 29.95,21.91 C11.2
N$17
  Bottom 0.254: 34.82,16.3 R18.1
  Bottom 0.406: R19.1 R18.1 | C23.2 34.82,16.3
N$18  (via drill 0.5 pad 0.69)
  Top 0.254: U$1.26 54.34,23.54 v56.2,25.4
  Bottom 0.254: v56.2,25.4 R15.2
N$19
  Bottom 0.254: IC1.17 46.24,24.33 47.31,25.4 47.31,27.2 R23.2
N$20
  Bottom 0.254: IC1.18 46.74,23.88 48.58,25.72 48.58,26.04 49.85,27.3 58.63,27.3 R22.2
N$21
  Bottom 0.305: R17.1 92.92,23.39 93.34,23.81 93.34,33.02 92.71,33.66 90.17,33.66 89.53,33.02 IC5.8
N$22
  Bottom 0.305: IC5.9 89.53,23.71 R16.2
N$23
  Bottom 0.254: IC1.19 47.24,23.43 49.21,25.4 49.21,25.72 50.16,26.67 66.78,26.67 R21.2
N$24
  Bottom 0.254: R30.1 R31.2 72.92,16.83 71.44,16.83 71.12,16.51 IC6.5 68,16.65 D2.2
N$25
  Bottom 0.254: IC6.3 64.45,15.24 65.09,14.61 65.09,12.38 64.14,11.43 60.43,11.43 R32.2 58.52,11.01 58.1,11.43 58.1,13.34 57.47,13.97 54.61,13.97 54.29,13.65 54.29,11.43 52.39,9.53 52.39,7.94 54.61,5.71 54.61,4.45 54.29,4.13 53.02,4.13 52.07,5.08 D3.2
N$26
  Bottom 0.254: R32.1 60.33,5.37 61.24,4.45 JP7.3
N$27
  Bottom 0.254: R29.1 55.24,10.3 Q7.1
N$28
  Bottom 0.406: JP7.2 58.74,6.22 R36.1
N$29
  Bottom 0.254: R33.1 70.38,15.24 IC6.6 IC6.7
N$30
  Bottom 0.305: R26.2 71.75,10.48 71.12,11.11 Q5.1
N$31
  Bottom 0.254: R26.1 71.75,4.76 JP3.2
N$32
  Bottom 0.305: R28.2 63.67,6.99 Q6.1
N$33  (via drill 0.51)
  Top 0.254: v78.74,1.59 79.69,1.59 80.64,2.54 JP2.2
  Bottom 0.305: v78.74,1.59 67.63,1.59 66.99,2.22 66.99,6.88 R28.1
N$34
  Bottom 0.406: Q7.3 55.73,7.16 56.83,8.26 57.47,8.26 58.1,8.89 R36.2
N$35
  Bottom 0.254: R34.1 59.16,12.7 IC6.1 IC6.2
N$36
  Bottom 0.406: 77.96,43.01 R37.1 79.52,41.45 Q8.1 80.69,42.44 C32.1 R38.1
N$37
  Bottom 0.406: Q9.1 16.02,5.35 R39.1
NMOS1_GATE
  Bottom 0.406: R1.1 70.8,27.73 71.39,28.31 | 71.39,28.31 R2.2 | Q1.3 70.17,29.53 71.39,28.31
NMOS2_GATE
  Bottom 0.406: Q2.3 62.06,32.87 62.23,32.7 63.72,32.7 R4.2 R3.1
NMOS3_GATE
  Bottom 0.406: Q3.3 49.63,30.16 R6.2 49.85,28.04 R5.1
NMOS4_GATE
  Bottom 0.406: Q4.3 35.46,28.89 R8.2 R7.1
NRST  (via drill 0.5, 0.5 pad 0.69)
  Top 0.254: v36.83,15.24 24.45,15.24 23.18,15.24 22.54,14.61 21.91,14.61 21.27,15.24 21.27,15.88 21.91,16.51 22.23,16.51 22.86,17.14 22.86,27.3 23.18,27.62 74.3,27.62 74.61,27.3 v78.11,27.3
  Bottom 0.203: 36.83,16.51 R18.2
  Bottom 0.254: 36.8,16.44 R18.2 | JP4.3 82.55,20.95 85.72,24.13 IC5.15 | IC1.7 40.39,16.44 40.01,16.83 39.69,17.14 37.78,17.14 37.47,16.83 37.05,16.83 | 37.05,16.83 R18.2 | 37.05,16.83 R18.2
  Bottom 0.305: IC5.15 85.72,28.57 84.45,29.84 83.19,29.84 82.55,29.21 80.96,29.21 79.06,27.3 v78.11,27.3
  Bottom 0.406: v36.83,15.24 36.83,16.51
OLED_DC  (via drill 0.5 pad 0.69)
  Top 0.254: U$1.15 46.64,18.77 46.64,18.45 47.62,17.46 50.16,17.46 52.07,19.37 v52.07,20
  Bottom 0.254: v52.07,20 52.07,19.77 IC1.25
OLED_RES  (via drill 0.5 pad 0.69)
  Top 0.254: U$1.14 45.94,18.2 47.31,16.83 51.12,16.83 v53.34,19.05
  Bottom 0.254: v53.34,19.05 53.02,19.05 52.7,18.73 52.41,18.44 IC1.26
OLED_VCC  (via drill 0.5 pad 0.69)
  Top 0.254: U$1.28 55.74,23.36 v56.83,24.45
  Bottom 0.254: v56.83,24.45 C15.2
OLED_VCOM  (via drill 0.5 pad 0.69)
  Top 0.254: U$1.27 55.04,19.89 v55.56,19.37
  Bottom 0.254: v55.56,19.37 C16.2
RPM_TRIG  (via drill 0.5)
  Top 0.254: v73.03,26.35 73.03,25.08 72.39,24.45 68.58,24.45 65.72,21.59 60.01,21.59 57.78,19.37 v57.78,15.88
  Bottom 0.254: IC1.32 57.35,15.44 v57.78,15.88 | v73.03,26.35 73.03,27.3 73.03,27.94 73.03,30.8 73.34,31.11 73.34,32.7 74.93,34.29 74.93,37.47 75.56,38.1 75.56,39.69 76.2,40.32 Q8.3
SCL  (via drill 0.5)
  Top 0.254: v31.75,11.75 35.24,11.75 39.05,7.94 39.05,4.76 39.37,4.45 v44.77,4.45
  Bottom 0.254: IC3.2 44.12,5.72 44.29,5.56 | 44.29,5.56 44.45,5.4 46.04,5.4 47.24,6.6 47.24,6.67 | R27.1 48.61,5.29 47.24,6.67 | 47.24,6.67 47.24,8.19 47.62,8.57 47.62,9.53 47.24,9.91 IC1.42 | IC7.4 29.47,16.25 30.16,15.56 30.16,13.34 v31.75,11.75 | v44.77,4.45 44.77,5.08 44.29,5.56
SDA  (via drill 0.5)
  Top 0.254: v48.26,7.94 47.62,7.94 v46.67,8.89 | v28.89,7.62 34.29,7.62 35.56,8.89 37.15,8.89 38.1,7.94 38.1,4.13 38.73,3.49 47.31,3.49 47.94,2.86 50.8,2.86 v51.75,3.81
  Bottom 0.254: IC3.3 44.77,7.63 45.4,8.26 46.04,8.26 v46.67,8.89 46.74,8.96 IC1.43 | v48.26,7.94 49.53,6.67 49.85,6.35 50.16,6.03 R20.1 50.27,3.81 v51.75,3.81 | IC7.6 26.75,13.26 28.26,11.75 28.26,8.26 v28.89,7.62
SG_OUT
  Bottom 0.254: R35.2 39.37,5.29 R11.1
  Bottom 0.406: IC2.6 R11.1
SPI_CLK  (via drill 0.5 pad 0.69)
  Top 0.254: 49.85,20 v50.8,20 49.85,20 | U$1.19 49.44,20.41 49.85,20
  Bottom 0.254: IC1.39 48.74,12.86 49.21,13.34 49.53,13.34 50.16,13.97 50.16,19.37 v50.8,20
SPI_MOSI  (via drill 0.5 pad 0.69)
  Top 0.254: U$1.18 48.74,18.89 v49.21,18.41
  Bottom 0.254: v49.21,18.41 49.21,16.51 49.53,16.19 49.53,14.61 49.53,14.29 49.21,13.97 48.9,13.97 47.94,13.02 47.74,12.81 IC1.41
SPI_NSS  (via drill 0.5 pad 0.69)
  Top 0.254: v48.58,10.48 48.26,10.48 46.99,11.75 46.99,13.65 45.4,15.24 44.77,15.88 44.77,17.15 45.24,17.62 U$1.13
  Bottom 0.254: IC1.38 49.24,11.14 v48.58,10.48
SWCLK  (via drill 0.5 pad 0.69)
  Top 0.254: JP4.2 79.69,16.19 78.42,14.92 77.15,14.92 74.3,12.06 74.3,7.94 73.03,6.67 51.12,6.67 v49.53,8.26
  Bottom 0.254: IC1.37 49.74,9.31 49.74,8.46 v49.53,8.26
SWDAT  (via drill 0.5 pad 0.69)
  Top 0.254: JP4.6 79.06,23.5 77.79,22.23 77.79,16.51 73.66,12.38 73.66,8.26 72.71,7.3 52.07,7.3 v50.8,8.57
  Bottom 0.254: IC1.34 52.55,14.44 53.02,13.97 53.02,12.06 50.8,9.84 v50.8,8.57
UART_RXD
  Bottom 0.254: IC1.31 56.27,15.94 57.15,16.83 60.33,16.83 62.55,19.05 62.55,20.32 65.09,22.86 73.66,22.86 76.2,25.4 76.2,28.57 76.83,29.21 78.74,29.21 79.06,29.53 80.33,29.53 80.64,29.84 82.23,29.84 83.19,30.8 84.77,30.8 85.09,31.11 IC5.1
UART_TXD
  Bottom 0.254: IC5.4 87,32.07 86.36,32.7 84.14,32.7 81.92,30.48 80.33,30.48 80.01,30.16 78.74,30.16 78.42,29.84 76.52,29.84 75.56,28.89 75.56,26.04 73.66,24.13 65.09,24.13 61.59,20.64 61.59,19.05 60.01,17.46 56.83,17.46 55.81,16.44 IC1.30
USB_DM
  Bottom 0.305: JP1.D- 89.06,15.09 90.17,16.19 90.17,17.14 89.85,17.46 89.85,21.38 R16.1
USB_DP
  Bottom 0.305: JP1.D+ 91.44,14.29 93.34,16.19 93.34,20.42 R17.2
USB_VBUS
  Bottom 0.305: JP1.VBUS 86.08,15.91 87.95,17.78 87.95,20.85 C19.1 87.63,22.01 IC5.12
  Bottom 0.406: JP1.VBUS 83.76,15.89 D4.A
VCC  (via drill 0.5, 0.5 pad 0.69, 0.6)
  Top 0.254: v81.92,27.62 81.92,29.84
  Top 0.406: JP7.4 63.82,4.19 64.83,3.17 68.26,3.17 69.22,2.22 72.71,2.22 74.61,4.13 JP3.3
  Top 0.61: JP3.3 74.61,5.4 v75.88,6.67
  Top 1.27: v20.64,20 20.64,31.11 22.86,33.34 v40.32,33.34 v54.93,33.34 v65.41,33.34 72.07,33.34 v74.61,30.8 75.56,29.84 81.92,29.84 82.55,30.48 89.53,30.48 92.71,27.3 92.71,11.11 91.12,9.53 87,9.53 83.19,5.71 JP2.3
  Bottom 0.254: R30.2 73.03,20.64 76.83,24.45 77.47,24.45 79.06,26.04 79.38,26.04 80.96,27.62 v81.92,27.62
  Bottom 0.406: v74.61,30.8 74.61,26.35 73.34,25.08 70.91,25.08 R1.2 | v65.41,33.34 65.41,29.84 64.56,29 R3.2 | R5.2 53.66,28.26 55.24,29.84 55.24,33.02 v54.93,33.34 | R7.2 39.05,27.62 40.32,28.89 v40.32,33.34
  Bottom 0.61: JP2.3 82.87,4.14 82.87,3.49 81.92,2.54 75.25,2.54 74.61,3.17 JP3.3 | D4.C 79.06,15.24 75.25,11.43 75.25,7.62 75.88,6.99 v75.88,6.67
  Bottom 0.813: D1.C 13.48,15.46 C1.1 20.36,15.49 IC4.3 20.36,19.72 v20.64,20
VIM
  Bottom 0.305: R14.1 R13.2 33.66,8.36 33.66,4.76 33.02,4.13 IC2.2
VIP
  Bottom 0.406: IC2.3 29.21,5.4 28.26,6.35 23.5,6.35 22.86,5.71 JP8.2

### Text on the board
tPlace: Github.com/mobyfab/OpenTCS | OpenTCS V0.1 | 1 | 1-GND | 2-COIL1 | 1-3V3 | 6 | 3-COIL2 | 2-SWCLK | 3-NRST | 4-COIL3 | 4-GND | 5-NC | 5-COIL4 | 6-SWDIO | 6-VBAT | 1 | 6